# Altium schematic sheet ASM001-design-4.SchDoc
size 558 x 431 mm
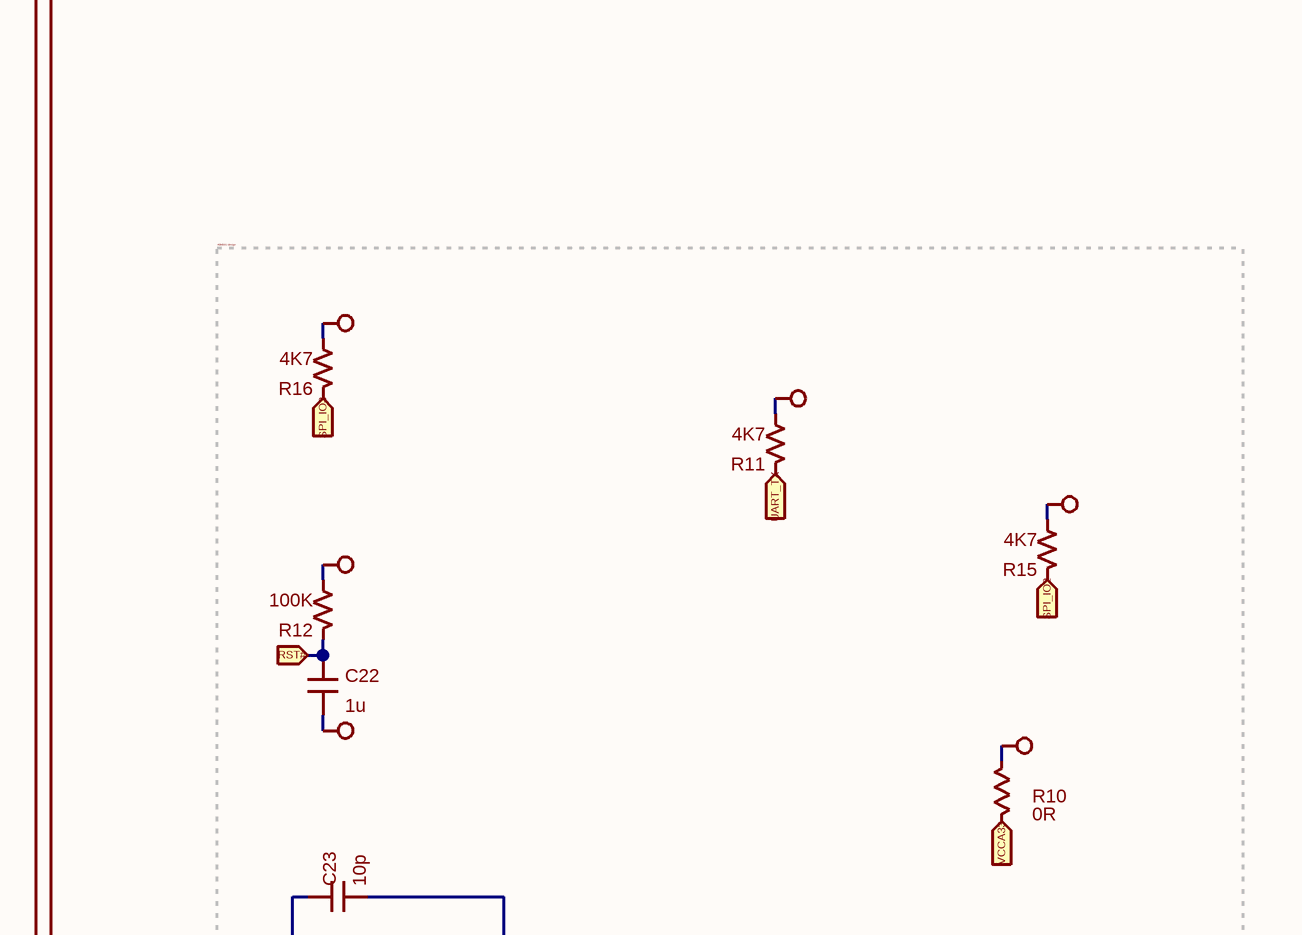
[diagram p0: ASM001-design-4.SchDoc, centre column 1 of 4]
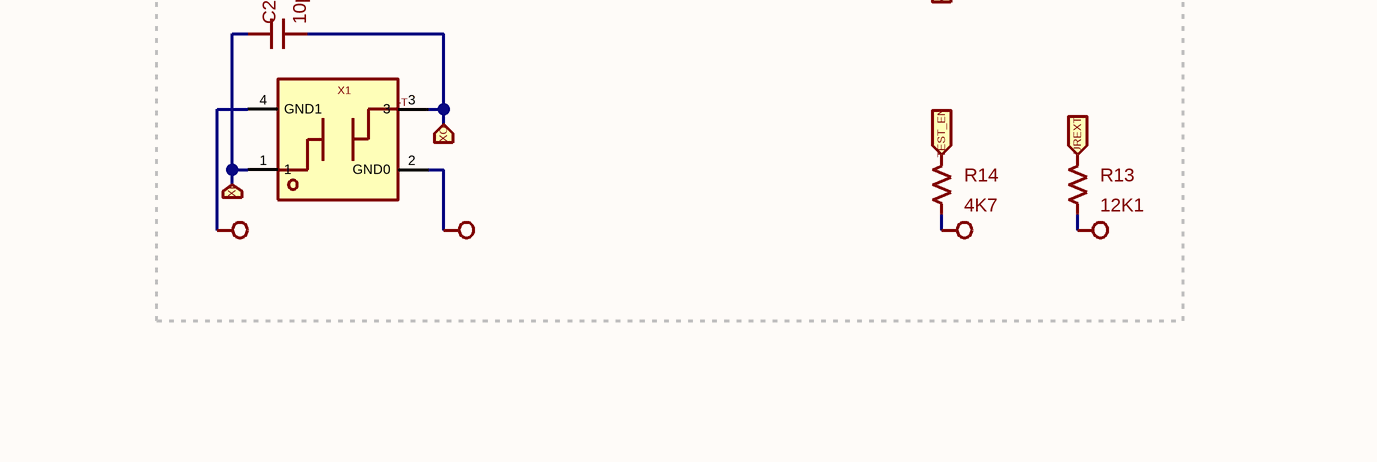
[diagram p1: ASM001-design-4.SchDoc, bottom column 1 of 4]
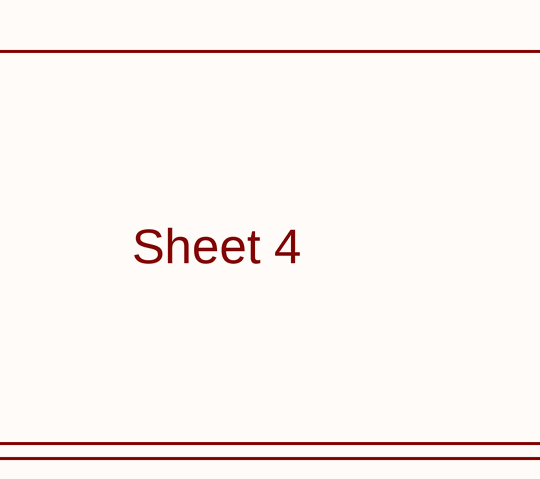
[diagram p2: ASM001-design-4.SchDoc, bottom column 4 of 4]

## Parts
C22  value 1u  [Pkg0402$2]  (hidden comment: C1518208)
C23  value 10p  [LP]  (hidden comment: my_capacitor)
R10  value 0R  [SMT_0201]  (hidden comment: C106228)
R11  value 4K7  [Pkg0402$10]  (hidden comment: my_resistor$7)
R12  value 100K  [Pkg0201$2]  (hidden comment: my_resistor$8)
R13  value 12K1  [Pkg0402$5]  (hidden comment: C168199)
R14  value 4K7  [Pkg0402$10]  (hidden comment: my_resistor$7)
R15  value 4K7  [Pkg0402$10]  (hidden comment: my_resistor$7)
R16  value 4K7  [Pkg0402$10]  (hidden comment: my_resistor$7)
X1  value ABMM2-25.000MHZ-D1-T  [LP$2]  (hidden comment: C1985419)

## Blocks framed on the sheet
ASM001-design: C22 C23 R10-R16 X1

## Ports
RST#, SPI_IO2, SPI_IO3, TEST_EN, UART_TX, UREXT, VCCA33, XI, XO

## Nets
NetC22_2: C22.2 R10.1 R11.2 R12.2 R13.2 R14.2 R15.2 R16.2 X1.2(GND0) X1.4(GND1)
RST#: C22.1 R12.1 ; port RST#
SPI_IO2: R15.1 ; port SPI_IO2
SPI_IO3: R16.1 ; port SPI_IO3
TEST_EN: R14.1 ; port TEST_EN
UART_TX: R11.1 ; port UART_TX
UREXT: R13.1 ; port UREXT
VCCA33: R10.2 ; port VCCA33
XI: C23.1 X1.1 ; port XI
XO: C23.2 X1.3 ; port XO

## Notes on the sheet
- Sheet 4

## Library data of the parts
C22 = C1518208: manufacturer_aliases: ["Murata Electronics"]; manufacturer: Murata Electronics; mpn_aliases: ["GRM155R61H105KE05D"]; mpn: GRM155R61H105KE05D; REFERENCE: false; capacitor: true; metadata.applications: General Purpose; metadata.packaging: Tape & Reel (TR); reference_prefix: C; area: 0.5; tolerance: Toleranced(9.0e-007 <= 1.0e-006 <= 1.1e-006); rated-voltage: 50.0; query-properties: ["case" => ["0201" "0402"] "rated-voltage" => 50.0 "capacitance" => 1.0e-006 "tolerance" => 0.1 "type" => "ceramic" "temperature-coefficient.code" => ["X7R" "X5R"] "category" => "capacitor" "mounting" => "smd" "min-stock" => 1 "_sellers" => ["JLCPCB"]]; trust: low; minimum_quantity: 5; cofactr_id: CCK5EGLHOV3I; rated-temperature: Toleranced(-55.0 <= 15.0 <= 85.0); capacitance: 1.0e-006; temperature-coefficent: X5R; y: 1.0; type: ceramic; metadata.description: 50V 1uF X5R ±10% 0402  Multilayer Ceramic Capacitors MLCC - SMD/SMT ROHS; Maximum Voltage: 50.0V; FOOTPRINT: ASM001-design:Pkg0402$2; vendor_part_numbers.lcsc: C1518208; price: 0.025652174; stock: 222336; mounting: smd; case: 0402; vendor_part_numbers.digi-key: 490-GRM155R61H105KE05DTR-ND; x: 0.5; category: capacitor; Datasheet: https://wmsc.lcsc.com/wmsc/upload/file/pdf/v2/lcsc/2201180430_Murata-Electronics-GRM155R61H105KE05D_C1518208.pdf
C23 = my_capacitor: mpn_aliases: ["04025A100FAT2A"]; manufacturer_aliases: ["AVX Corporation"]; MPN: 04025A100FAT2A; Manufacturer: KYOCERA AVX; REFERENCE: false; cofactr_id: CCOVHWU6D1V4; metadata.applications: General Purpose; metadata.packaging: Tape & Reel (TR); reference_prefix: C; rated-temperature: Toleranced(-55.0 <= 35.0 <= 125.0); area: 0.5; tolerance: Toleranced(9.9e-012 <= 1.0e-011 <= 1.01e-011); capacitance: 1.0e-011; temperature-coefficent: C0G; rated-voltage: 50.0; trust: low; y: 1.0; z: 0.56; type: ceramic; metadata.description: CAP CER 10PF 50V NP0 0402; Maximum Voltage: 50.0V; FOOTPRINT: ASM001-design:LP; mounting: smd; case: 0402; x: 0.5; category: capacitor; Datasheet: https://datasheets.avx.com/C0GNP0-Dielectric.pdf
R10 = C106228: MPN: RC0201JR-070RL; Manufacturer: YAGEO; REFERENCE: false; Maximum Power: 0.05W; FOOTPRINT: ASM001-design:SMT_0201; Resistance: 0R; Datasheet: https://www.lcsc.com/datasheet/lcsc_datasheet_2304140030_YAGEO-RC0201JR-070RL_C106228.pdf
R11 R14-R16 = my_resistor$7: mpn_aliases: ["SCR0402F4K7"]; mpn: SCR0402F4K7; manufacturer_aliases: ["VO"]; manufacturer: VO; REFERENCE: false; cofactr_id: RC99FREJ1KLN; reference_prefix: R; resistor: true; area: 0.5; tolerance: Toleranced(4653.0 <= 4700.0 <= 4747.0); query-properties: ["case" => ["0201" "0402"] "resistance" => 4700.0 "tolerance" => 0.01 "category" => "resistor" "mounting" => "smd" "min-stock" => 1 "_sellers" => ["JLCPCB"]]; trust: low; y: 1.0; resistance: 4700.0; minimum_quantity: 20; metadata.description: ±1% 4.7kΩ 0402  Chip Resistor - Surface Mount ROHS; FOOTPRINT: ASM001-design:Pkg0402$10; vendor_part_numbers.lcsc: C3015810; mounting: smd; price: 0.000405797; case: 0402; stock: 1006; x: 0.5; category: resistor; Datasheet: https://wmsc.lcsc.com/wmsc/upload/file/pdf/v2/lcsc/2206021130_VO-SCR0402F4K7_C3015810.pdf
R12 = my_resistor$8: mpn_aliases: ["SC0201F1003G1BNRH"]; mpn: SC0201F1003G1BNRH; manufacturer_aliases: ["Sunway"]; manufacturer: Sunway; REFERENCE: false; reference_prefix: R; resistor: true; area: 0.18; tolerance: Toleranced(99000.0 <= 100000.0 <= 101000.0); query-properties: ["case" => ["0201" "0402"] "resistance" => 100000.0 "tolerance" => 0.01 "category" => "resistor" "mounting" => "smd" "min-stock" => 1 "_sellers" => ["JLCPCB"]]; x: 0.3; trust: low; y: 0.6; resistance: 100000.0; minimum_quantity: 20; rated-power: 0.05; metadata.description: 50mW ±1% ±200ppm/℃ 100kΩ 0201  Chip Resistor - Surface Mount ROHS; Maximum Power: 0.05W; FOOTPRINT: ASM001-design:Pkg0201$2; vendor_part_numbers.lcsc: C3152012; mounting: smd; price: 0.000463768; case: 0201; stock: 11487; category: resistor; Datasheet: https://datasheet.lcsc.com/lcsc/2207281830_Sunway-SC0201F1003G1BNRH_C3152012.pdf
R13 = C168199: manufacturer_aliases: ["Walsin Technology Corporation"]; manufacturer: Walsin Technology Corporation; mpn_aliases: ["WR04X1212FTL"]; mpn: WR04X1212FTL; REFERENCE: false; metadata.number-of-terminations: 2.0; TCR: [-0.0001 0.0001]; metadata.packaging: Tape & Reel (TR); reference_prefix: R; resistor: true; area: 0.5; tolerance: Toleranced(11979.0 <= 12100.0 <= 12221.0); query-properties: ["tolerance" => 0.01 "case" => ["0201" "0402"] "resistance" => 12100.0 "category" => "resistor" "mounting" => "smd" "min-stock" => 1 "_sellers" => ["JLCPCB"]]; trust: low; minimum_quantity: 20; cofactr_id: XX5RG112LRR9; rated-temperature: Toleranced(-55.0 <= 50.0 <= 155.0); y: 1.0; resistance: 12100.0; rated-power: 0.063; metadata.description: 62.5mW Thick Film Resistors ±100ppm/℃ ±1% 12.1kΩ 0402  Chip Resistor - Surface Mount ROHS; Maximum Power: 0.063W; FOOTPRINT: ASM001-design:Pkg0402$5; vendor_part_numbers.lcsc: C168199; price: 0.000362319; stock: 3370; mounting: smd; composition: thick-film; case: 0402; metadata.supplier-device-package: 402; vendor_part_numbers.digi-key: 1292-WR04X1212FTLTR-ND; x: 0.5; type: chip; category: resistor; Datasheet: https://www.lcsc.com/datasheet/lcsc_datasheet_2304140030_Walsin-Tech-Corp-WR04X1212FTL_C168199.pdf
X1 = C1985419: manufacturer_aliases: ["Abracon LLC"]; mpn_aliases: ["ABMM2-25.000MHZ-D1-T"]; Manufacturer: ABRACON; REFERENCE: false; cofactr_id: OSDU487NIJMB; reference_prefix: X; x: 6.302; trust: low; y: 3.901; area: 24.584; FOOTPRINT: ASM001-design:LP$2; case: SMD6036-4P; mounting: smd; category: resonator; MPN: ABMM2-25.000MHZ-D1-T; Datasheet: https://wmsc.lcsc.com/wmsc/upload/file/pdf/v2/lcsc/2304140030_Abracon-LLC-ABMM2-25-000MHZ-D1-T_C1985419.pdf